# EAGLE schematic relay-set-d-decode (EAGLE 7.6.0)
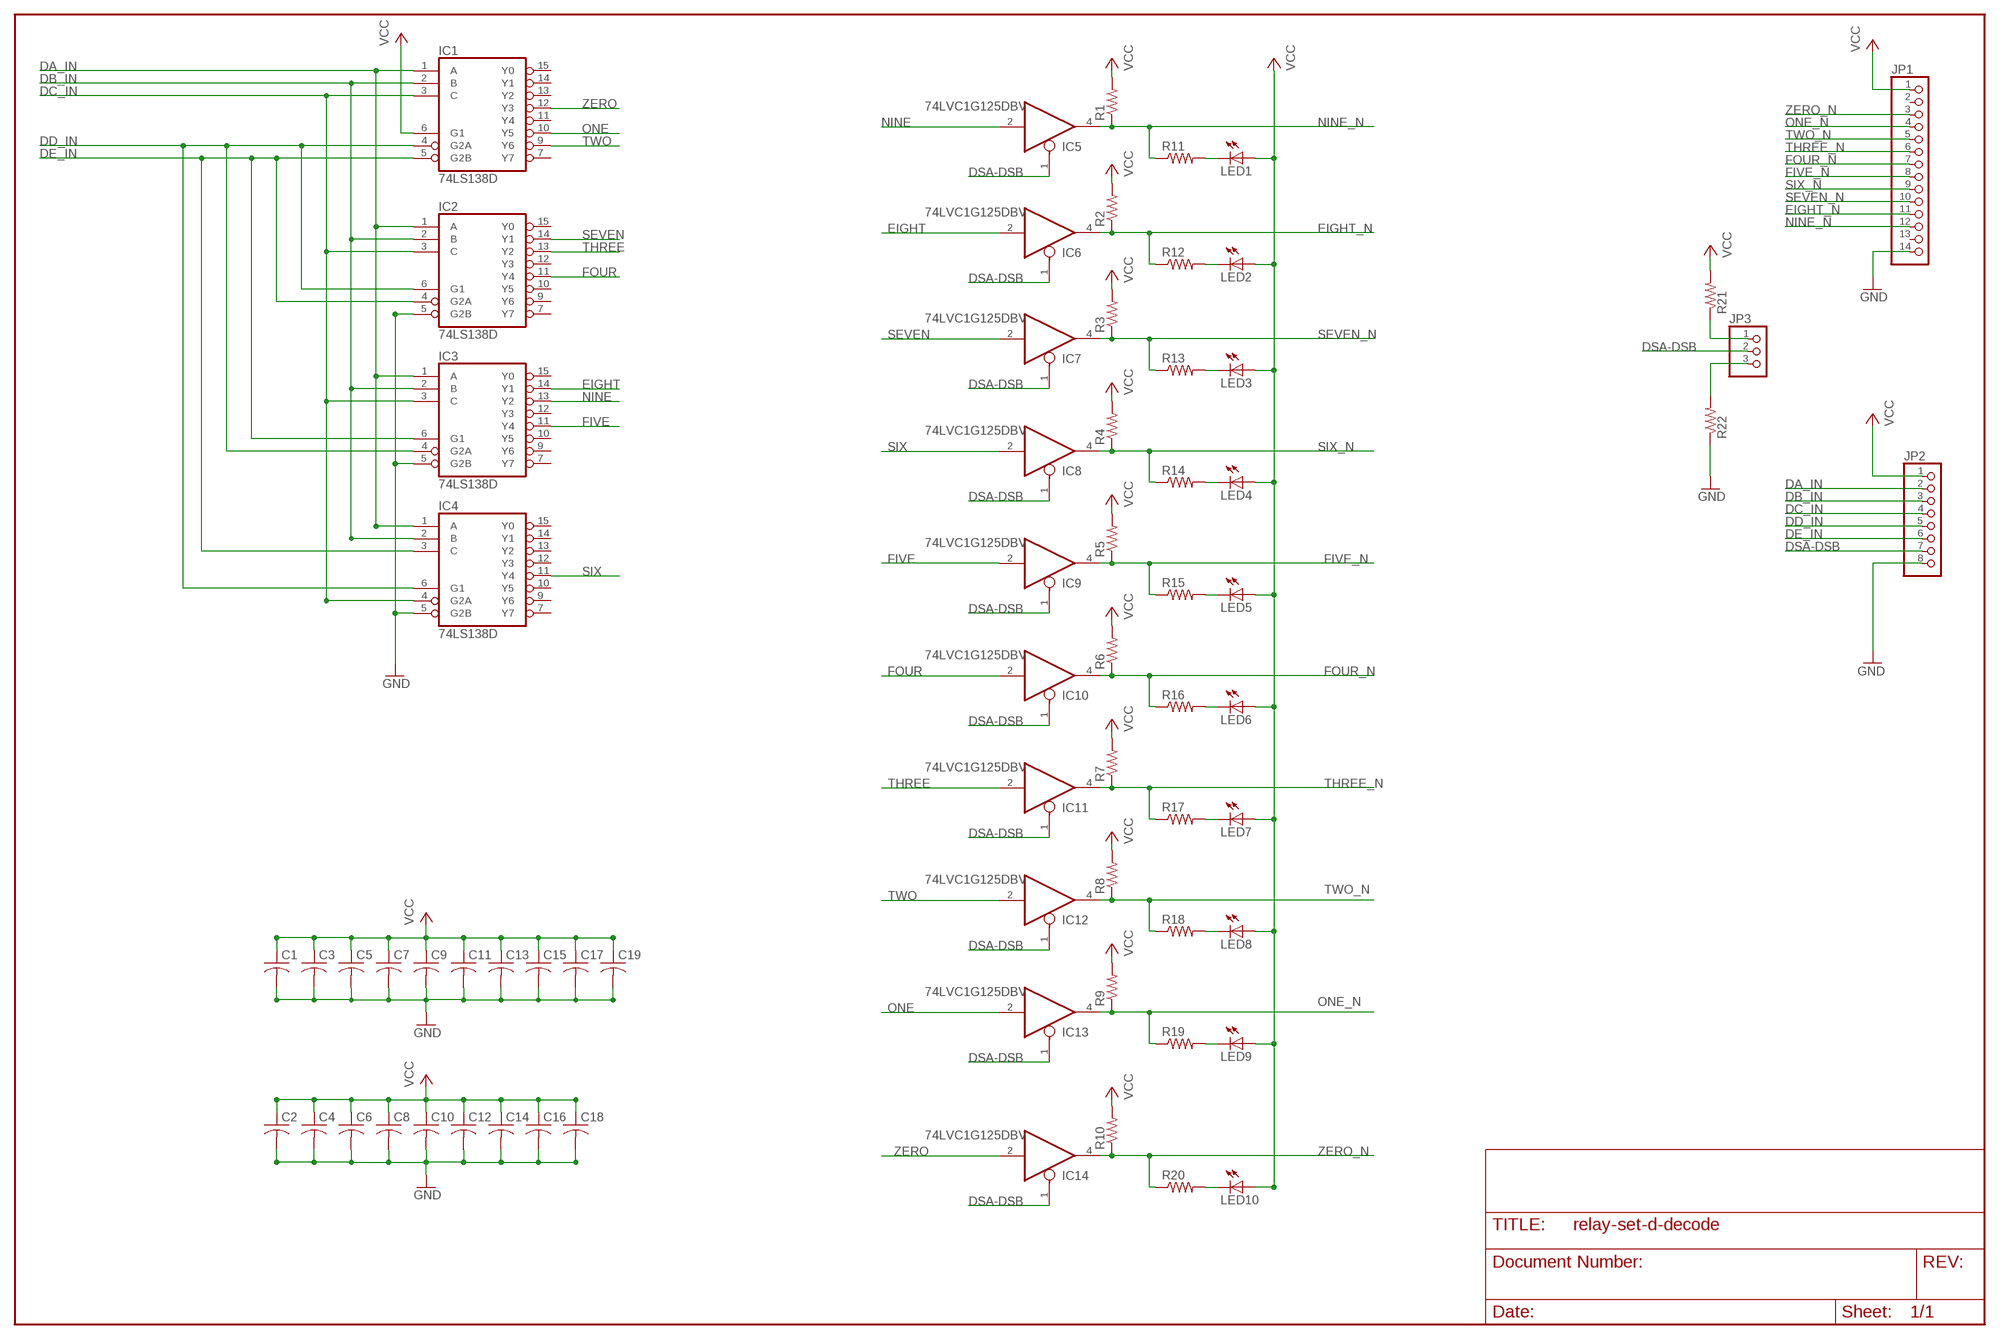
[diagram p0: schematic, sheet 1]

## Parts
C1  C-USC0805  [C0805]
C2  C-USC0805  [C0805]
C3  C-USC0805  [C0805]
C4  C-USC0805  [C0805]
C5  C-USC0805  [C0805]
C6  C-USC0805  [C0805]
C7  C-USC0805  [C0805]
C8  C-USC0805  [C0805]
C9  C-USC0805  [C0805]
C10  C-USC0805  [C0805]
C11  C-USC0805  [C0805]
C12  C-USC0805  [C0805]
C13  C-USC0805  [C0805]
C14  C-USC0805  [C0805]
C15  C-USC0805  [C0805]
C16  C-USC0805  [C0805]
C17  C-USC0805  [C0805]
C18  C-USC0805  [C0805]
C19  C-USC0805  [C0805]
IC1  74LS138D  [SO16]
IC2  74LS138D  [SO16]
IC3  74LS138D  [SO16]
IC4  74LS138D  [SO16]
IC5  74LVC1G125DBV  [SOT23-5]
IC6  74LVC1G125DBV  [SOT23-5]
IC7  74LVC1G125DBV  [SOT23-5]
IC8  74LVC1G125DBV  [SOT23-5]
IC9  74LVC1G125DBV  [SOT23-5]
IC10  74LVC1G125DBV  [SOT23-5]
IC11  74LVC1G125DBV  [SOT23-5]
IC12  74LVC1G125DBV  [SOT23-5]
IC13  74LVC1G125DBV  [SOT23-5]
IC14  74LVC1G125DBV  [SOT23-5]
JP1  PINHD-1X14  [1X14]
JP2  PINHD-1X8  [1X08]
JP3  PINHD-1X3  [1X03]
LED1  LEDCHIP-LED0805  [CHIP-LED0805]
LED2  LEDCHIP-LED0805  [CHIP-LED0805]
LED3  LEDCHIP-LED0805  [CHIP-LED0805]
LED4  LEDCHIP-LED0805  [CHIP-LED0805]
LED5  LEDCHIP-LED0805  [CHIP-LED0805]
LED6  LEDCHIP-LED0805  [CHIP-LED0805]
LED7  LEDCHIP-LED0805  [CHIP-LED0805]
LED8  LEDCHIP-LED0805  [CHIP-LED0805]
LED9  LEDCHIP-LED0805  [CHIP-LED0805]
LED10  LEDCHIP-LED0805  [CHIP-LED0805]
R1  R-US_R0805  [R0805]
R2  R-US_R0805  [R0805]
R3  R-US_R0805  [R0805]
R4  R-US_R0805  [R0805]
R5  R-US_R0805  [R0805]
R6  R-US_R0805  [R0805]
R7  R-US_R0805  [R0805]
R8  R-US_R0805  [R0805]
R9  R-US_R0805  [R0805]
R10  R-US_R0805  [R0805]
R11  R-US_R0805  [R0805]
R12  R-US_R0805  [R0805]
R13  R-US_R0805  [R0805]
R14  R-US_R0805  [R0805]
R15  R-US_R0805  [R0805]
R16  R-US_R0805  [R0805]
R17  R-US_R0805  [R0805]
R18  R-US_R0805  [R0805]
R19  R-US_R0805  [R0805]
R20  R-US_R0805  [R0805]
R21  R-US_R0805  [R0805]
R22  R-US_R0805  [R0805]

## Nets
DA_IN: IC1.1(A) IC2.1(A) IC3.1(A) IC4.1(A) JP2.2
DB_IN: IC1.2(B) IC2.2(B) IC3.2(B) IC4.2(B) JP2.3
DC_IN: IC1.3(C) IC2.3(C) IC3.3(C) IC4.4(G2A) JP2.4
DD_IN: IC1.4(G2A) IC2.6(G1) IC3.4(G2A) IC4.6(G1) JP2.5
DE_IN: IC1.5(G2B) IC2.4(G2A) IC3.6(G1) IC4.3(C) JP2.6
DSA-DSB: IC5.1(OE) IC6.1(OE) IC7.1(OE) IC8.1(OE) IC9.1(OE) IC10.1(OE) IC11.1(OE) IC12.1(OE) IC13.1(OE) IC14.1(OE) JP2.7 JP3.2
EIGHT: IC3.14(Y1) IC6.2(I)
EIGHT_N: IC6.4(O) JP1.11 R2.1 R12.1
FIVE: IC3.11(Y4) IC9.2(I)
FIVE_N: IC9.4(O) JP1.8 R5.1 R15.1
FOUR: IC2.11(Y4) IC10.2(I)
FOUR_N: IC10.4(O) JP1.7 R6.1 R16.1
GND: C1.2 C2.2 C3.2 C4.2 C5.2 C6.2 C7.2 C8.2 C9.2 C10.2 C11.2 C12.2 C13.2 C14.2 C15.2 C16.2 C17.2 C18.2 C19.2 IC2.5(G2B) IC3.5(G2B) IC4.5(G2B) JP1.14 JP2.8 R22.1
N$1: LED1.C R11.2
N$2: LED2.C R12.2
N$3: LED3.C R13.2
N$4: LED4.C R14.2
N$5: LED5.C R15.2
N$6: LED6.C R16.2
N$7: LED7.C R17.2
N$8: LED8.C R18.2
N$9: LED9.C R19.2
N$10: LED10.C R20.2
N$11: JP3.1 R21.1
N$13: JP3.3 R22.2
NINE: IC3.13(Y2) IC5.2(I)
NINE_N: IC5.4(O) JP1.12 R1.1 R11.1
ONE: IC1.10(Y5) IC13.2(I)
ONE_N: IC13.4(O) JP1.4 R9.1 R19.1
SEVEN: IC2.14(Y1) IC7.2(I)
SEVEN_N: IC7.4(O) JP1.10 R3.1 R13.1
SIX: IC4.11(Y4) IC8.2(I)
SIX_N: IC8.4(O) JP1.9 R4.1 R14.1
THREE: IC2.13(Y2) IC11.2(I)
THREE_N: IC11.4(O) JP1.6 R7.1 R17.1
TWO: IC1.9(Y6) IC12.2(I)
TWO_N: IC12.4(O) JP1.5 R8.1 R18.1
VCC: C1.1 C2.1 C3.1 C4.1 C5.1 C6.1 C7.1 C8.1 C9.1 C10.1 C11.1 C12.1 C13.1 C14.1 C15.1 C16.1 C17.1 C18.1 C19.1 IC1.6(G1) JP1.1 JP2.1 LED1.A LED2.A LED3.A LED4.A LED5.A LED6.A LED7.A LED8.A LED9.A LED10.A R1.2 R2.2 R3.2 R4.2 R5.2 R6.2 R7.2 R8.2 R9.2 R10.2 R21.2
ZERO: IC1.12(Y3) IC14.2(I)
ZERO_N: IC14.4(O) JP1.3 R10.1 R20.1
Unconnected: IC1.7(Y7) IC1.11(Y4) IC1.13(Y2) IC1.14(Y1) IC1.15(Y0) IC2.7(Y7) IC2.9(Y6) IC2.10(Y5) IC2.12(Y3) IC2.15(Y0) IC3.7(Y7) IC3.9(Y6) IC3.10(Y5) IC3.12(Y3) IC3.15(Y0) IC4.7(Y7) IC4.9(Y6) IC4.10(Y5) IC4.12(Y3) IC4.13(Y2) IC4.14(Y1) IC4.15(Y0) JP1.2 JP1.13

## Power pins joined to a net without a drawn wire
GND: IC1.8(GND) IC2.8(GND) IC3.8(GND) IC4.8(GND) IC5.3(GND) IC6.3(GND) IC7.3(GND) IC8.3(GND) IC9.3(GND) IC10.3(GND) IC11.3(GND) IC12.3(GND) IC13.3(GND) IC14.3(GND)
VCC: IC1.16(VCC) IC2.16(VCC) IC3.16(VCC) IC4.16(VCC) IC5.5(VCC) IC6.5(VCC) IC7.5(VCC) IC8.5(VCC) IC9.5(VCC) IC10.5(VCC) IC11.5(VCC) IC12.5(VCC) IC13.5(VCC) IC14.5(VCC)

## Library data of the parts
C1-C19 = resistor:C-US: CAPACITOR, American symbol
IC1-IC4 = 74xx-us:74*138: 3-line to 8-line DECODER/DEMULTIPLEXER
IC5-IC14 = 74xx-little-us:74*1G125: Single Bus Buffer Gate with 3-State Output
JP1 = pinhead:PINHD-1X14: PIN HEADER
JP2 = pinhead:PINHD-1X8: PIN HEADER
JP3 = pinhead:PINHD-1X3: PIN HEADER
LED1-LED10 = led:LED: LED OSRAM: - CHIPLED LG R971, LG N971, LY N971, LG Q971, LY Q971, LO R971, LY R971 LH N974, LH R974 LS Q976, LO Q976, LY Q976 LO Q996 - Hyper CHIPLED LW Q18S LB Q993, LB Q99A, LB R99A - SideLED LS A670, LO A670, LY A670, LG A670, LP A670 LB A673, LV A673, LT A673, LW A673 LH A674 LY A675 LS A676, LA A676, LO A676, LY A676, LW A676 LS A679, LY A679, LG A679 - Hyper Micro SIDELED® LS Y876, LA Y876, LO Y876, LY Y876 LT Y87S - SmartLED LW L88C, LW L88S LB L89C, LB L89S, LG L890 LS L89K, LO L89K, LY L89K LS L896, LA L896, LO L896, LY L896 - TOPLED LS T670, LO T670, LY T670, LG T670, LP T670 LSG T670, LSP T670, LSY T670, LOP T670, LYG T670 LG T671, LOG T671, LSG T671 LB T673, LV T673, LT T673, LW T673 LH T674 LS T676, LA T676, LO T676, LY T676, LB T676, LH T676, LSB T676, LW T676 LB T67C, LV T67C, LT T67C, LS T67K, LO T67K, LY T67K, LW E67C LS E67B, LA E67B, LO E67B, LY E67B, LB E67C, LV E67C, LT E67C LW T67C LS T679, LY T679, LG T679 LS T770, LO T770, LY T770, LG T770, LP T770 LB T773, LV T773, LT T773, LW T773 LH T774 LS E675, LA E675, LY E675, LS T675 LS T776, LA T776, LO T776, LY T776, LB T776 LHGB T686 LT T68C, LB T68C - Hyper Mini TOPLED® LB M676 - Mini TOPLED Santana® LG M470 LS M47K, LO M47K, LY M47K Source: http://www.osram.convergy.de LUXEON: - LUMILED® LXK2-PW12-R00, LXK2-PW12-S00, LXK2-PW14-U00, LXK2-PW14-V00 LXK2-PM12-R00, LXK2-PM12-S00, LXK2-PM14-U00 LXK2-PE12-Q00, LXK2-PE12-R00, LXK2-PE12-S00, LXK2-PE14-T00, LXK2-PE14-U00 LXK2-PB12-K00, LXK2-PB12-L00, LXK2-PB12-M00, LXK2-PB14-N00, LXK2-PB14-P00, LXK2-PB14-Q00 LXK2-PR12-L00, LXK2-PR12-M00, LXK2-PR14-Q00, LXK2-PR14-R00 LXK2-PD12-Q00, LXK2-PD12-R00, LXK2-PD12-S00 LXK2-PH12-R00, LXK2-PH12-S00 LXK2-PL12-P00, LXK2-PL12-Q00, LXK2-PL12-R00 Source: www.luxeon.com KINGBRIGHT: KA-3528ASYC Source: www.kingbright.com
R1-R22 = resistor:R-US_: RESISTOR, American symbol